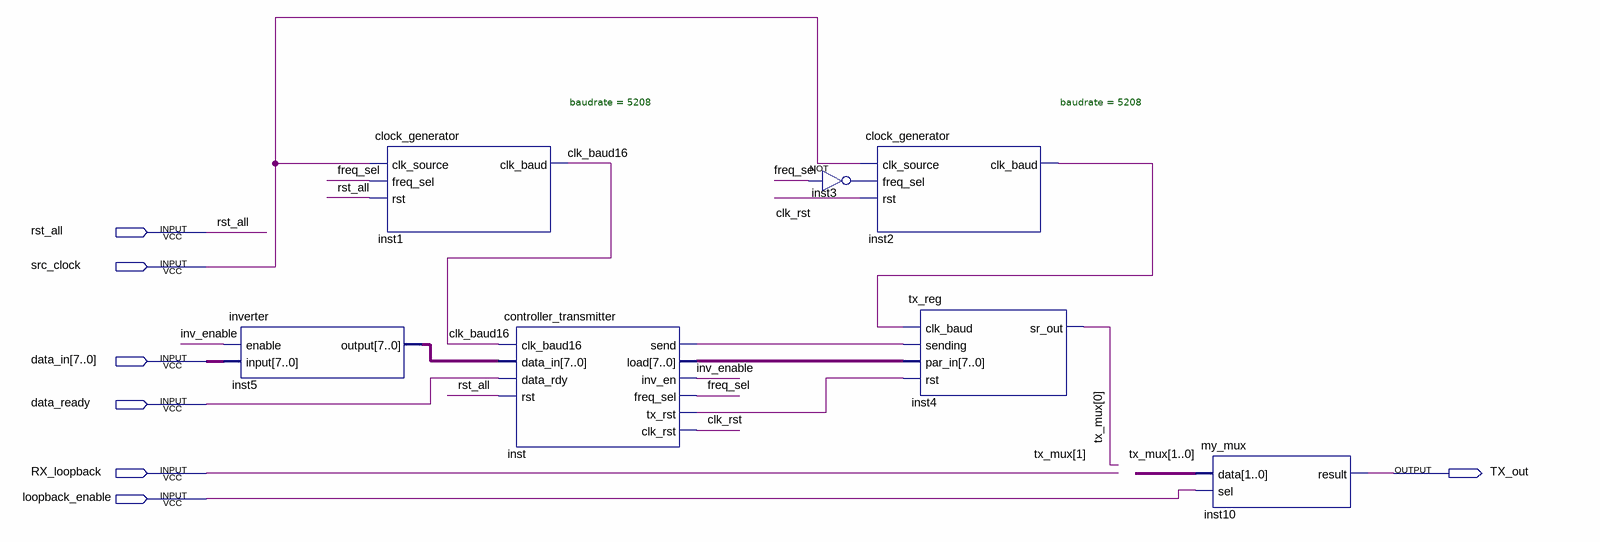
[diagram p0: schematic sheet]
// Quartus schematic outgoing_block.bdf as structural Verilog: 7 symbols, 7 pins
module outgoing_block (
  input  rst_all,
  input  src_clock,
  input  [7:0] data_in,
  input  data_ready,
  input  RX_loopback,
  input  loopback_enable,
  output TX_out
);

  wire clk_baud16, clk_rst, freq_sel, inst2_clk_baud, inst3_out, inst_send, inst_tx_rst, inv_enable;
  wire [0:0] tx_mux;
  wire [7:0] inst5_output, inst_load;

  inverter inst5 (.enable(inv_enable), .\input (data_in), .\output (inst5_output));
  clock_generator #(.baudrate(5208)) inst1 (
    .clk_source(src_clock), .freq_sel(freq_sel), .rst(rst_all), .clk_baud(clk_baud16));
  controller_transmitter inst (
    .clk_baud16(clk_baud16), .data_in(inst5_output), .data_rdy(data_ready), .rst(rst_all), .send(inst_send),
    .load(inst_load), .inv_en(inv_enable), .freq_sel(freq_sel), .tx_rst(inst_tx_rst), .clk_rst(clk_rst));
  not inst3 (inst3_out, freq_sel);
  clock_generator #(.baudrate(5208)) inst2 (
    .clk_source(src_clock), .freq_sel(inst3_out), .rst(clk_rst), .clk_baud(inst2_clk_baud));
  tx_reg inst4 (
    .clk_baud(inst2_clk_baud), .sending(inst_send), .par_in(inst_load), .rst(inst_tx_rst), .sr_out(tx_mux[0]));
  my_mux inst10 (.data({RX_loopback, tx_mux[0]}), .sel(loopback_enable), .result(TX_out));

  // Other names for the same wires on the sheet: tx_mux[1] = RX_loopback
endmodule
